# Altium project arduino_nano_min_sys.PrjPcb
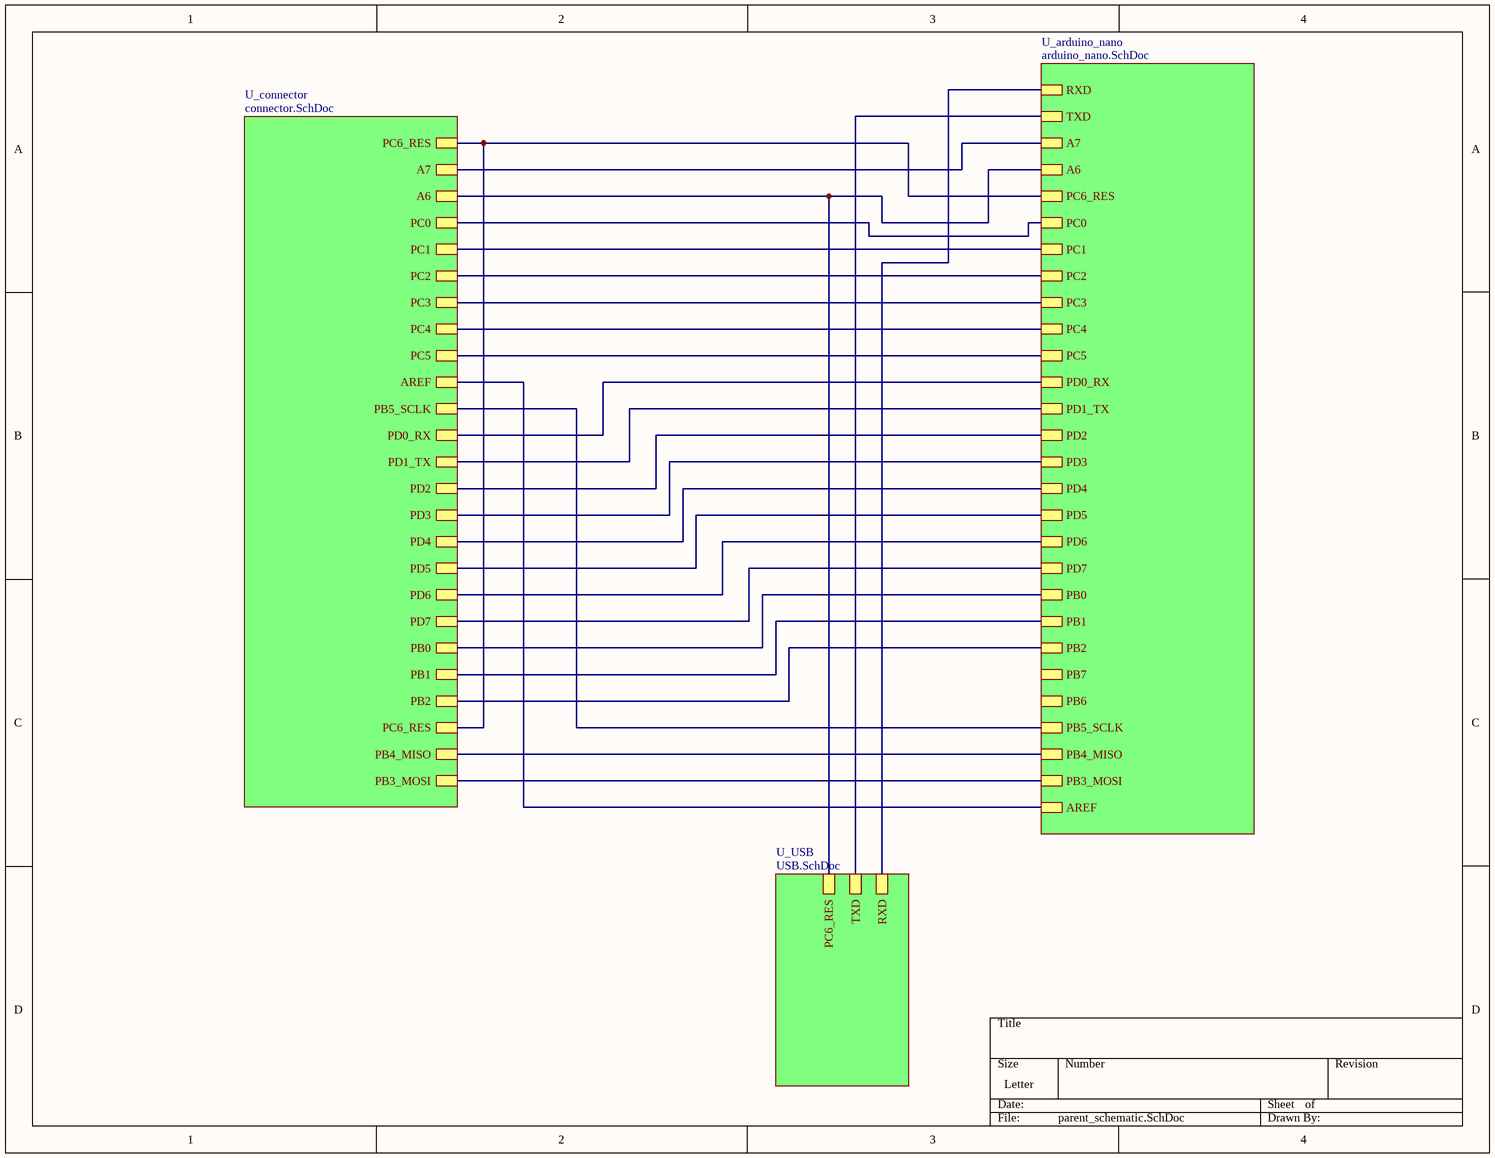
[diagram p0: parent_schematic.SchDoc]
2 sheets, 9 parts. Net scope: hierarchical (ports join the sheet entries above them; power ports are global).
Board files: arduino_nano_min_sys.PcbDoc, arduino_nano_v2.PcbDoc, arduino_nano_v3.PcbDoc
Sheets:
  parent_schematic.SchDoc
    U_USB = USB.SchDoc

## Sheet parent_schematic.SchDoc
size Letter; SheetNumber: 1; SheetTotal: 4

### Sub-sheets
U_arduino_nano = arduino_nano.SchDoc (file not in this document): RXD, TXD, A7, A6, PC6_RES, PC0, PC1, PC2, PC3, PC4, PC5, PD0_RX, PD1_TX, PD2, PD3, PD4, PD5, PD6, PD7, PB0, PB1, PB2, PB7, PB6, PB5_SCLK, PB4_MISO, PB3_MOSI, AREF
U_connector = connector.SchDoc (file not in this document): PC6_RES, A7, A6, PC0, PC1, PC2, PC3, PC4, PC5, AREF, PB5_SCLK, PD0_RX, PD1_TX, PD2, PD3, PD4, PD5, PD6, PD7, PB0, PB1, PB2, PC6_RES, PB4_MISO, PB3_MOSI
U_USB = USB.SchDoc: RXD, TXD, PC6_RES

### Nets
NetC4_2: sheet U_arduino_nano/A6, sheet U_connector/A6, sheet U_USB/PC6_RES
NetU_USB_1: sheet U_arduino_nano/RXD, sheet U_USB/RXD
NetU_USB_5: sheet U_arduino_nano/TXD, sheet U_USB/TXD
(unnamed): sheet U_arduino_nano/A7, sheet U_connector/A7
(unnamed): sheet U_arduino_nano/PC6_RES, sheet U_connector/PC6_RES, sheet U_connector/PC6_RES
(unnamed): sheet U_arduino_nano/PC0, sheet U_connector/PC0
(unnamed): sheet U_arduino_nano/PC1, sheet U_connector/PC1
(unnamed): sheet U_arduino_nano/PC2, sheet U_connector/PC2
(unnamed): sheet U_arduino_nano/PC3, sheet U_connector/PC3
(unnamed): sheet U_arduino_nano/PC4, sheet U_connector/PC4
(unnamed): sheet U_arduino_nano/PC5, sheet U_connector/PC5
(unnamed): sheet U_arduino_nano/PD0_RX, sheet U_connector/PD0_RX
(unnamed): sheet U_arduino_nano/PD1_TX, sheet U_connector/PD1_TX
(unnamed): sheet U_arduino_nano/PD2, sheet U_connector/PD2
(unnamed): sheet U_arduino_nano/PD3, sheet U_connector/PD3
(unnamed): sheet U_arduino_nano/PD4, sheet U_connector/PD4
(unnamed): sheet U_arduino_nano/PD5, sheet U_connector/PD5
(unnamed): sheet U_arduino_nano/PD6, sheet U_connector/PD6
(unnamed): sheet U_arduino_nano/PD7, sheet U_connector/PD7
(unnamed): sheet U_arduino_nano/PB0, sheet U_connector/PB0
(unnamed): sheet U_arduino_nano/PB1, sheet U_connector/PB1
(unnamed): sheet U_arduino_nano/PB2, sheet U_connector/PB2
(unnamed): sheet U_arduino_nano/PB5_SCLK, sheet U_connector/PB5_SCLK
(unnamed): sheet U_arduino_nano/PB4_MISO, sheet U_connector/PB4_MISO
(unnamed): sheet U_arduino_nano/PB3_MOSI, sheet U_connector/PB3_MOSI
(unnamed): sheet U_arduino_nano/AREF, sheet U_connector/AREF

## Sheet USB.SchDoc
size A; SheetNumber: 3; SheetTotal: 4
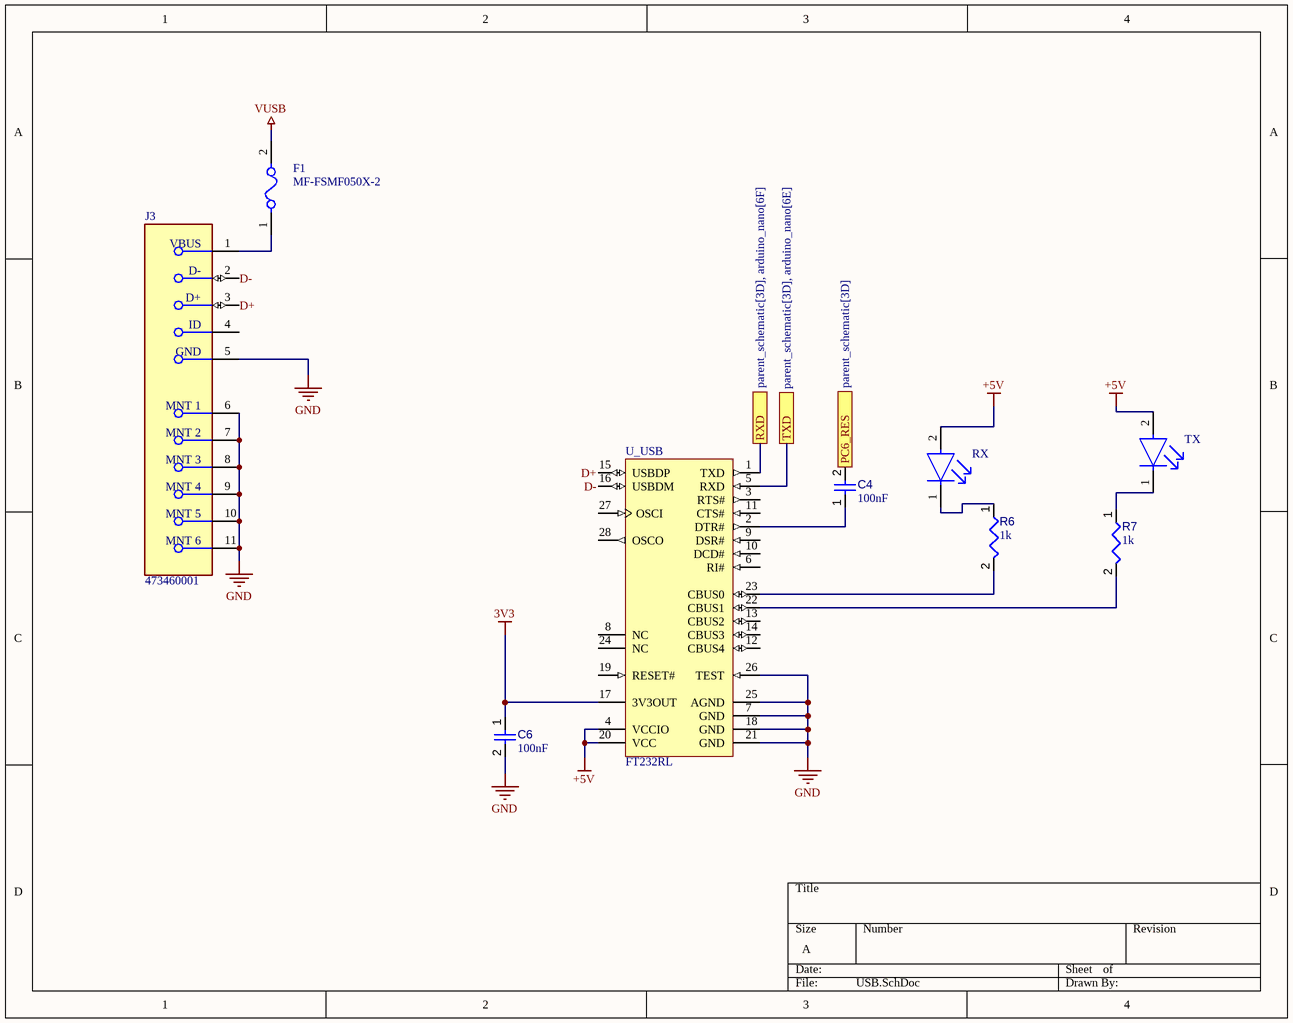
[diagram p1: USB.SchDoc]

### Parts
C4  value 100nF  [CAPC0402(1005)60_L]  (hidden comment: Capacitor 100nF +/-20% 25V 0402)
C6  value 100nF  [CAPC0402(1005)60_L]  (hidden comment: Capacitor 100nF +/-20% 25V 0402)
F1  MF-FSMF050X-2  [FP-MF-FSMF-MFG]
J3  473460001  [FP-473460001-MFG]
R6  value 1k  [RESC2012X70N]  (hidden comment: ERJP06J102V_with_model)
R7  value 1k  [RESC2012X70N]  (hidden comment: ERJP06J102V_with_model)
RX  (no value)  [FP-APTD1608SYC-J3-MFG]
TX  (no value)  [FP-APTD1608SYC-J3-MFG]
U_USB  FT232RL  [FTDI-SSOP-28_M]

### Ports
PC6_RES (see parent_schematic[3D]), RXD (see parent_schematic[3D], arduino_nano[6F]), TXD (see parent_schematic[3D], arduino_nano[6E])

### Nets
3V3: C6.1 U_USB.17(3V3OUT)
+5V: RX.2(A) TX.2(A) U_USB.4(VCCIO) U_USB.20(VCC)
GND: C6.2 J3.5(GND) J3.6(MNT_1) J3.7(MNT_2) J3.8(MNT_3) J3.9(MNT_4) J3.10(MNT_5) J3.11(MNT_6) U_USB.7(GND) U_USB.18(GND) U_USB.21(GND) U_USB.25(AGND) U_USB.26(TEST)
VUSB: F1.2
D+: J3.3(D+) U_USB.15(USBDP)
D-: J3.2(D-) U_USB.16(USBDM)
NetC4_1: C4.1 U_USB.2(DTR#)
NetC4_2: C4.2 ; port PC6_RES
NetF1_1: F1.1 J3.1(VBUS)
NetR6_1: R6.1 RX.1(C)
NetR6_2: R6.2 U_USB.23(CBUS0)
NetR7_1: R7.1 TX.1(C)
NetR7_2: R7.2 U_USB.22(CBUS1)
NetU_USB_1: U_USB.1(TXD) ; port RXD
NetU_USB_5: U_USB.5(RXD) ; port TXD

Not connected (* = marked no-connect by the designer): J3 4(ID); U_USB 3(RTS#) 6(RI#) 8(NC) 9(DSR#) 10(DCD#) 11(CTS#) 12(CBUS4) 13(CBUS2) 14(CBUS3) 19(RESET#) 24(NC) 27(OSCI) 28(OSCO)

### Library data of the parts
C4 C6 = CMP-001-00065-4: Chip Capacitor, 100nF +/-20%, 25V, 0402, Thickness 0.6 mm; Tolerance: 10%; Max Operating Temperature: 85°C; Min Operating Temperature: -55°C; Pins: 2; Voltage Rating: 25V; Mounting Technology: SMT; Case/Package: 0402
F1 = CMP-07400-000010-1: PTC RESET FUSE 6V 500MA 0603; Manufacturer: Bourns Inc.; Trip Current: 1A; Current Rating: 40A; Hold Current: 0.5A; Resistance: 0.1-0.8Ω; Value: 0.1-0.8Ω; Trip Time: 0.1s; Mouser Description: Resettable Fuses - PPTC 6volts 40amps; Category: Fuse; Digikey Description: PTC RESET FUSE 6V 500MA 0603; Temperature: -40°C to +85°C; Device Class L3: unset; Automotive: No; RoHS: TRUE; Ambient Temperature Range High: +85°C; Device Class L2: PTC Resettable Fuses; Temperature Range High: +85°C; Voltage Rating: 6V; Package: MF-FSMF; Manufacturer Part Number: MF-FSMF050X-2; Ambient Temperature Range Low: -40°C; Lead Free: Yes; ComponentLink2Description: Datasheet; Octopart: https://octopart.com/mf-fsmf050x-2-bourns-10470804; ComponentLink2URL: https://www.bourns.com/docs/Product-Datasheets/mffsmf.pdf; Temperature Range Low: -40°C; Height: 1mm; Device Class L1: Circuit Protection
J3 = CMP-2000-05246-2: CONN RCPT USB2.0 MICRO B SMD R/A; Manufacturer: Molex; Conn Orientation: Right Angle; Is Female: yes; Shielding: true; Pitch: 0.65mm; Number Of Contacts: 5; Voltage Rating: 30V; Current Rating: 1.8A; Device Class L2: USB Connectors; Digikey Description: CONN RCPT USB2.0 MICRO B SMD R/A; Height: 2.945mm; RoHS: TRUE; ComponentLink2Description: Datasheet; Octopart: https://octopart.com/47346-0001-molex-7164928; Automotive: No; Package: 0; Category: Conn; Device Class L1: Connectors; Usb Standard: USB 2.0; Temperature: -30°C to +85°C; Temperature Range Low: -30°C; Footprint Url: https://www.molex.com/pdm_docs/sd/473460001_sd.pdf; ComponentLink2URL: https://www.molex.com/webdocs/datasheets/pdf/en-us/0473460001_IO_CONNECTORS.pdf; Lead Free: Yes; Manufacturer Part Number: 473460001; Contact Material: Gold,Nickel; Temperature Range High: +85°C; Device Class L3: unset
R6 R7 = CMP-009-00186-3: Res Thick Film 0805 1K Ohm 5% 0.5W(1/2W) ±200ppm/C Pad SMD Automotive T/R; Voltage Rating: 400V; Max Operating Temperature: 155°C; Tolerance: 5%; Case/Package: 0805; Min Operating Temperature: -55°C; Mounting Technology: Surface Mount
RX TX = CMP-44529-000016-1: LED YELLOW CLEAR CHIP SMD; Forward Current: 20mA; Luminous Intensity: 900mcd; Dominant Wavelength: 590nm; Viewing Angle: 60°; Lens Color: Colorless; Forward Voltage: 2V; Case Code (Imperial): 0603; Lens Transparency: Clear; Height: 0.95mm; Case Code (Metric): 1608; Package Quantity: 2000; Mount: Surface Mount; Test Current: 20mA; Max Operating Temperature: 85°C; Length: 1.6mm; Lens Style: Clear; Illumination Color: Yellow; Packaging: Tape and Reel; Case/Package: 0603; Color: Yellow; Width: 0.8mm; Lead Free: Lead Free; Min Operating Temperature: -40°C
U_USB = CMP-2000-05029-1: IC USB FS SERIAL UART 28-SSOP; Manufacturer: FTDI; Receive FIFO: 256B; Number of Channels per Chip: 1; Maximum Data Rate: 3MBd; Transmit FIFO: 128B; Dimensions: 10.2x5.3x1.75mm; Mounting Type: SurfaceMount; Height: 1.75mm; Package Type: SSOP; Datasheet Version: Rev. 1.04, 02/2006; Width: 5.3mm; Manufacturer URL: http://www.ftdichip.com/; Datasheet URL: http://datasheet.octopart.com/FT232RL-FTDI-datasheet-120501.pdf; Maximum Operating Temperature: +85degC; Minimum Operating Temperature: -40degC; Pin Count: 28; Length: 10.2mm